# EAGLE design Atmelboard_test (EAGLE 5.09)
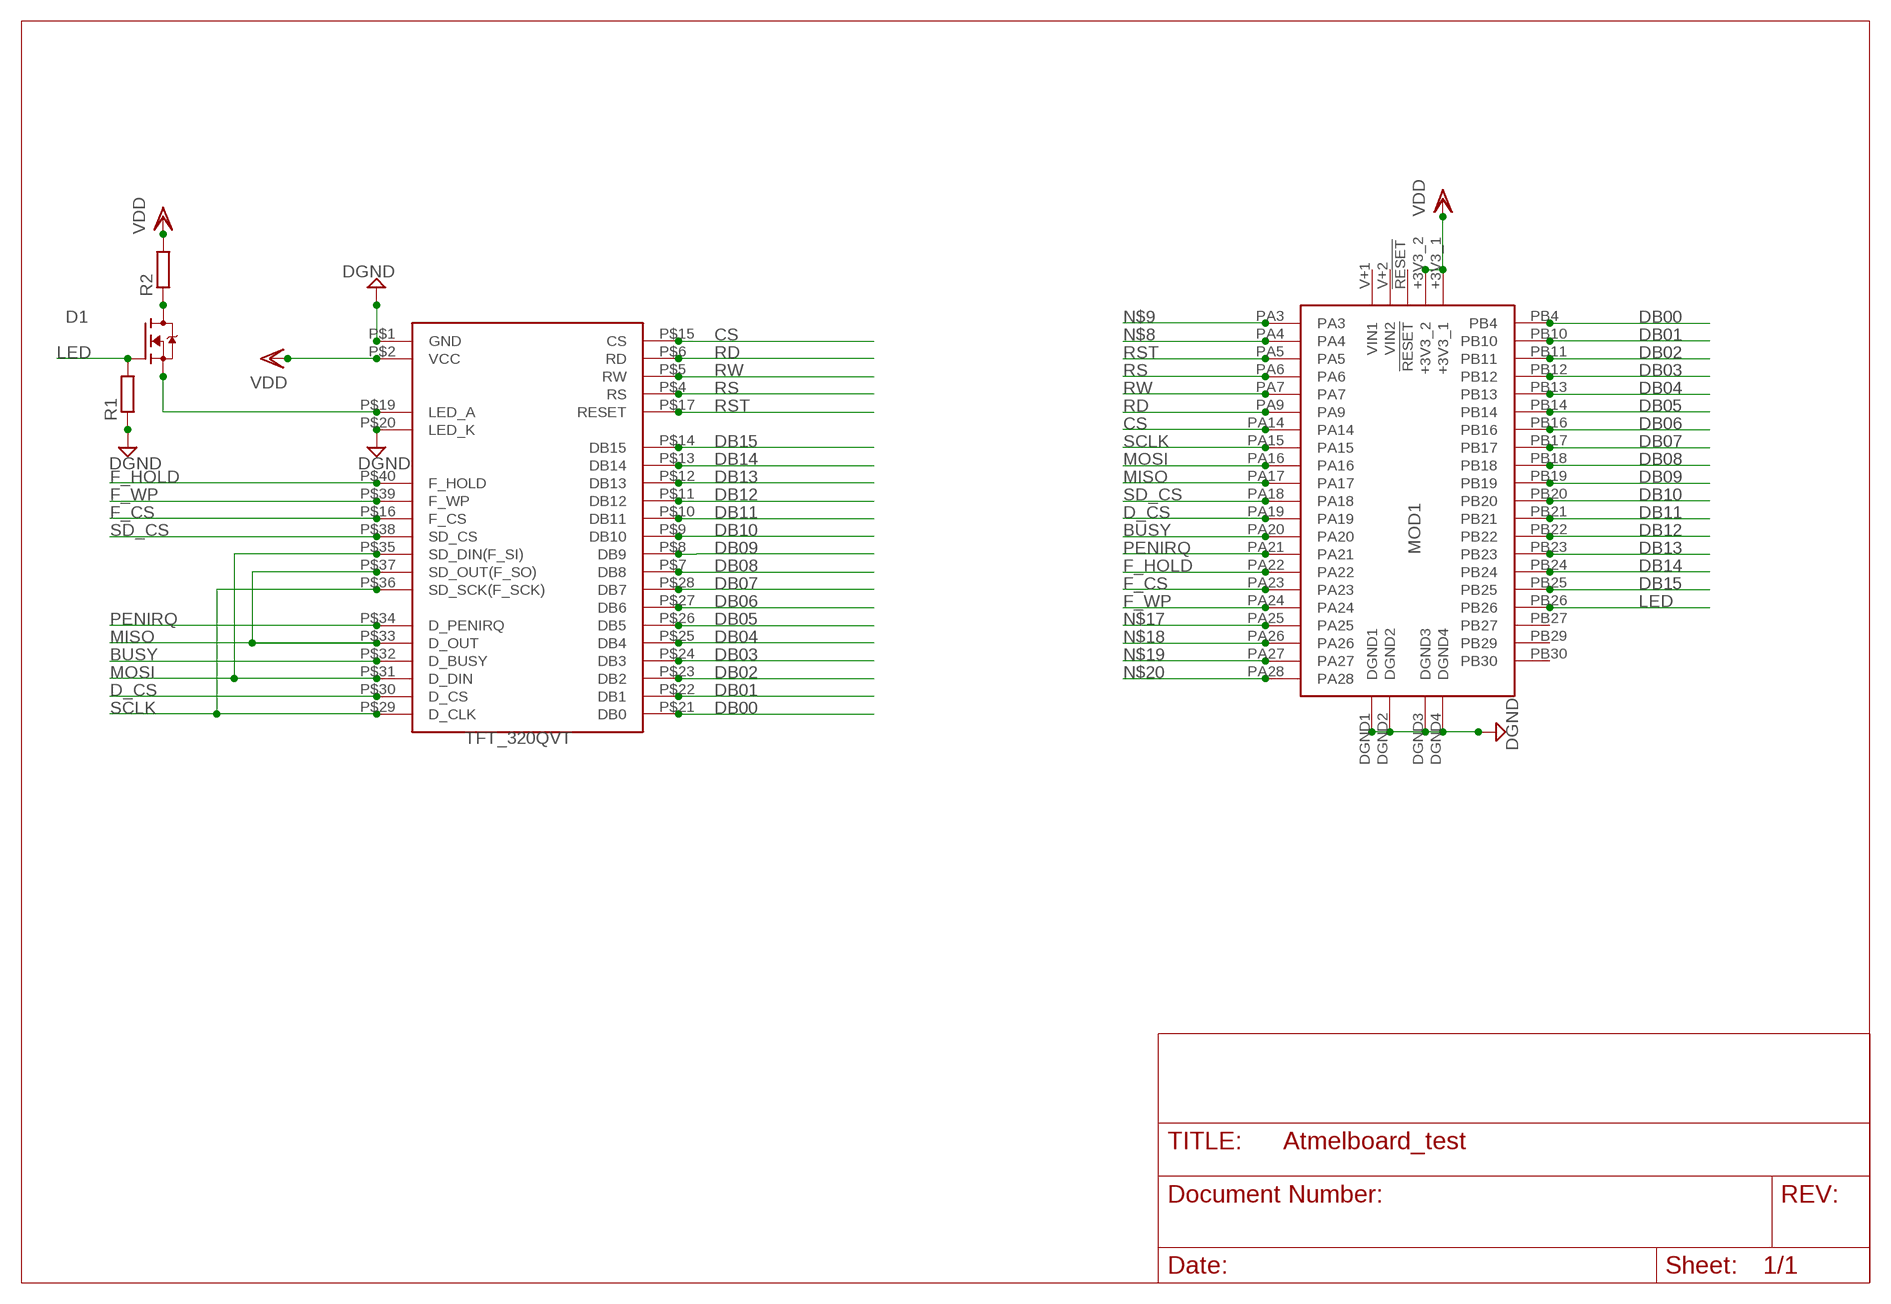
[diagram p0: schematic, sheet 1]

## Parts
D1  FDV303  [SOT23]
MOD1  ATMEL_EMPC  [EMPC_ATMEL]
R1  R-EU_0207/10  [0207/10]
R2  R-EU_0207/10  [0207/10]
TFT1  TFT_320QVT  [TFT320_QVT]

## Nets
BUSY: MOD1.PA20 TFT1.P$32(D_BUSY)
CS: MOD1.PA14 TFT1.P$15(CS)
D_CS: MOD1.PA19 TFT1.P$30(D_CS)
DB00: MOD1.PB4 TFT1.P$21(DB0)
DB01: MOD1.PB10 TFT1.P$22(DB1)
DB02: MOD1.PB11 TFT1.P$23(DB2)
DB03: MOD1.PB12 TFT1.P$24(DB3)
DB04: MOD1.PB13 TFT1.P$25(DB4)
DB05: MOD1.PB14 TFT1.P$26(DB5)
DB06: MOD1.PB16 TFT1.P$27(DB6)
DB07: MOD1.PB17 TFT1.P$28(DB7)
DB08: MOD1.PB18 TFT1.P$7(DB8)
DB09: MOD1.PB19 TFT1.P$8(DB9)
DB10: MOD1.PB20 TFT1.P$9(DB10)
DB11: MOD1.PB21 TFT1.P$10(DB11)
DB12: MOD1.PB22 TFT1.P$11(DB12)
DB13: MOD1.PB23 TFT1.P$12(DB13)
DB14: MOD1.PB24 TFT1.P$13(DB14)
DB15: MOD1.PB25 TFT1.P$14(DB15)
DGND: MOD1.DGND1 MOD1.DGND2 MOD1.DGND3 MOD1.DGND4 R1.1 TFT1.P$1(GND) TFT1.P$20(LED_K)
F_CS: MOD1.PA23 TFT1.P$16(F_CS)
F_HOLD: MOD1.PA22 TFT1.P$40(F_HOLD)
F_WP: MOD1.PA24 TFT1.P$39(F_WP)
LED: D1.1(G) MOD1.PB26 R1.2
MISO: MOD1.PA17 TFT1.P$33(D_OUT) TFT1.P$37(SD_OUT(F_SO))
MOSI: MOD1.PA16 TFT1.P$31(D_DIN) TFT1.P$35(SD_DIN(F_SI))
N$3: D1.3(D) R2.1
N$4: D1.2(S) TFT1.P$19(LED_A)
N$8: MOD1.PA4
N$9: MOD1.PA3
N$17: MOD1.PA25
N$18: MOD1.PA26
N$19: MOD1.PA27
N$20: MOD1.PA28
PENIRQ: MOD1.PA21 TFT1.P$34(D_PENIRQ)
RD: MOD1.PA9 TFT1.P$6(RD)
RS: MOD1.PA6 TFT1.P$4(RS)
RST: MOD1.PA5 TFT1.P$17(RESET)
RW: MOD1.PA7 TFT1.P$5(RW)
SCLK: MOD1.PA15 TFT1.P$29(D_CLK) TFT1.P$36(SD_SCK(F_SCK))
SD_CS: MOD1.PA18 TFT1.P$38(SD_CS)
VDD: MOD1.+3V3_1 MOD1.+3V3_2 R2.2 TFT1.P$2(VCC)
Unconnected: MOD1.!RESET MOD1.PB27 MOD1.PB29 MOD1.PB30

## Power pins joined to a net without a drawn wire
VIN1: MOD1.V+1(VIN1)
VIN2: MOD1.V+2(VIN2)

## Library data of the parts
D1 = transistor-fet:FDV303
MOD1 = extra_dev:ATMEL_EMPC
R1 R2 = rcl:R-EU_: RESISTOR, European symbol
TFT1 = extra_dev:TFT_320QVT

## Net classes
0 default: clearance 0.15 mm

## Board
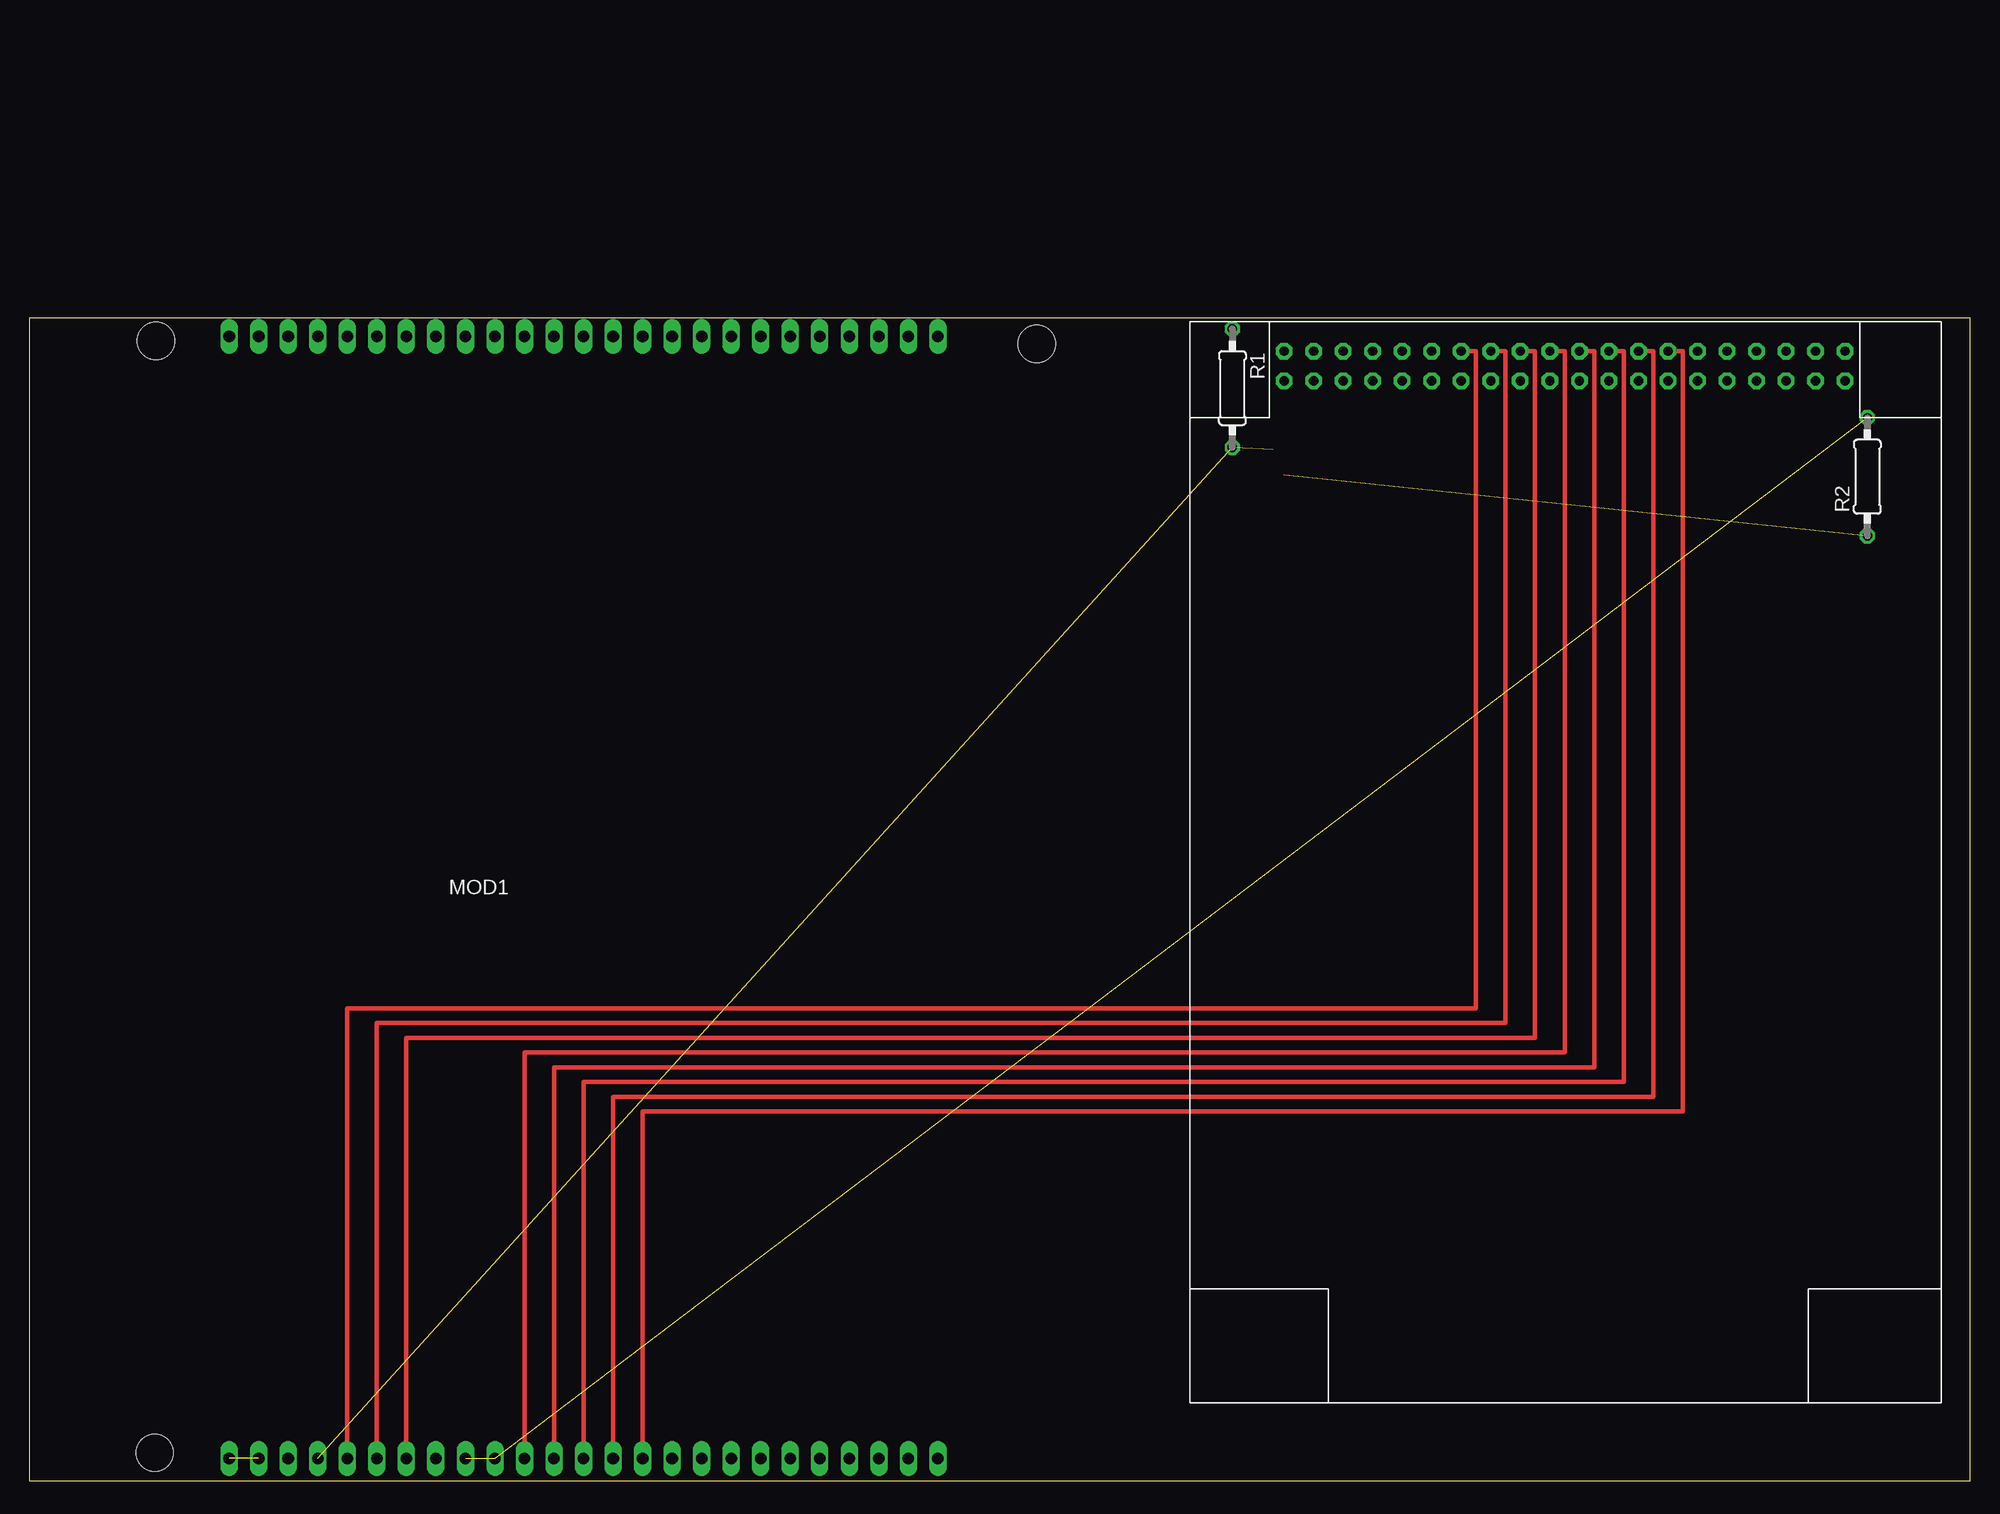
[diagram p1: board, top side]
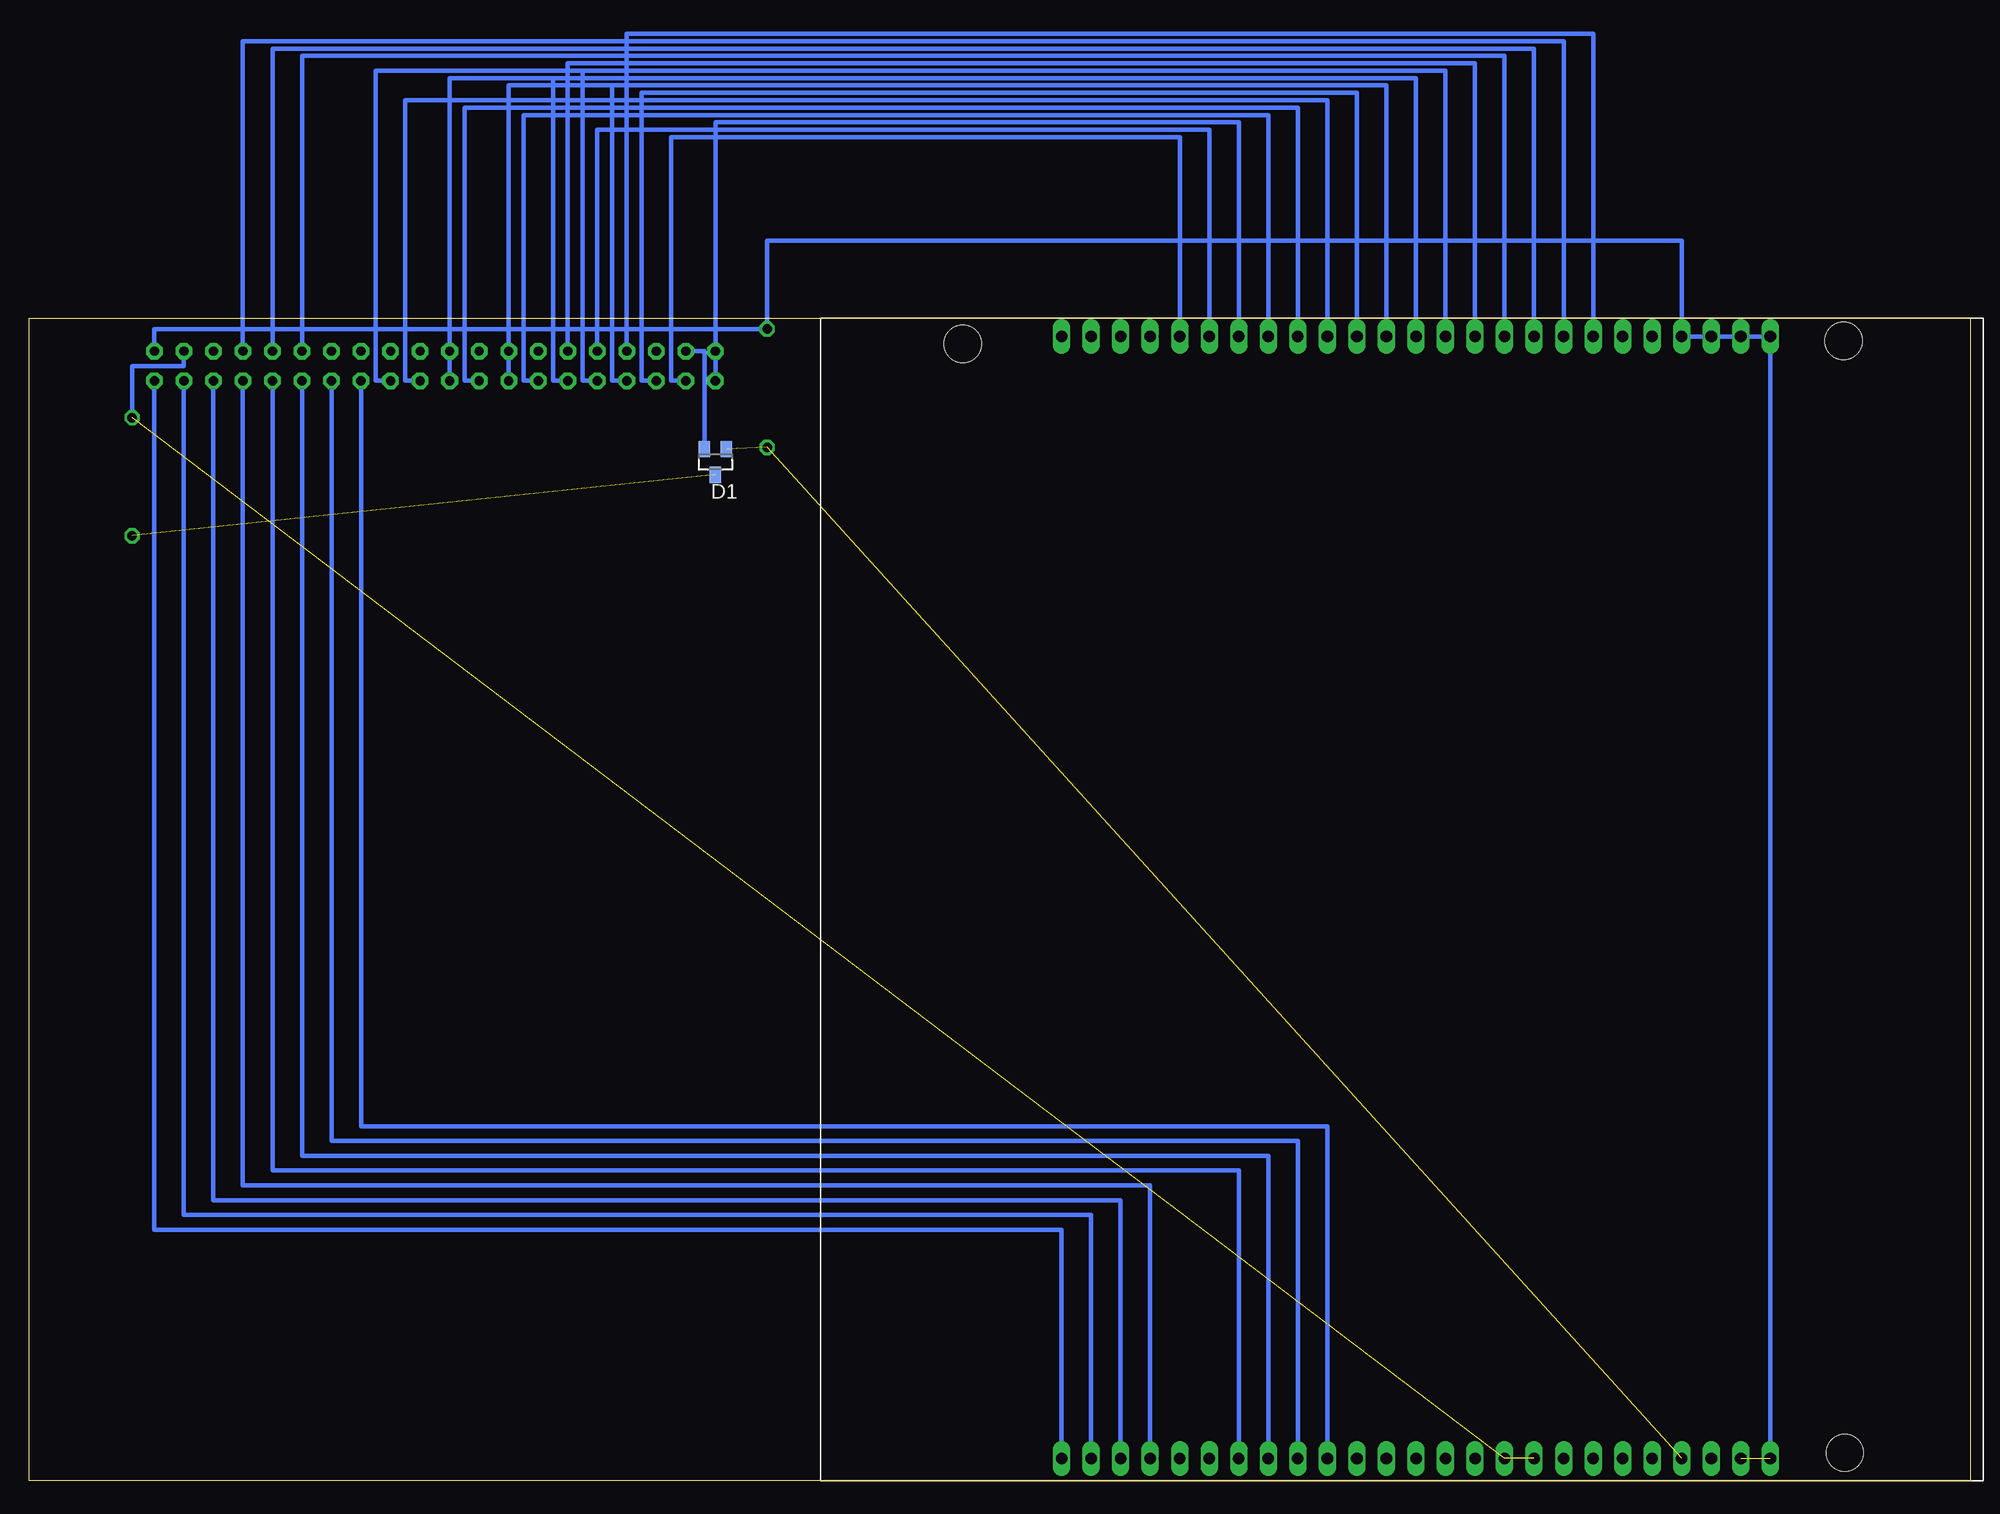
[diagram p2: board, bottom side, seen from below]

Size 166.99 x 100 mm. Coordinates in mm from the lower left corner, seen from the top.
Outline: 0,0 166.99,0 166.99,100 0,100 0,0
Copper layers (1*16): Top 0.035mm / dielectric 1.5mm / Bottom 0.035mm
Design rules "default": minimum track width 10mil, minimum drill 24mil, track to track 8mil, track to pad 8mil, pad to pad 8mil, via to via 8mil, smd to smd 8mil, copper to edge 40mil, drill to drill 8mil, minimum pad ring 10mil, minimum via ring 8mil, stop-mask expansion 4mil, vias tented up to drill 0mil, thermal gap 10mil

### Footprints (pad centres in the part's own frame; a part is rotated, then mirrored left to right if it is on the bottom)
SOT23 = smd 1 x 1.4: 1 -0.95,-1.1; 2 0.95,-1.1; 3 0,1.1
EMPC_ATMEL = drill 1 pad 1.5 long: !RESET 36.263,1.905; +3V3_1 41.343,1.905; +3V3_2 38.803,1.905; DGND1 26.102,98.425; DGND2 23.562,98.425; DGND3 21.023,1.905; DGND4 18.483,1.905; PA3 28.642,98.425; PA4 31.183,98.425; PA5 33.722,98.425; PA6 36.263,98.425; PA7 38.803,98.425; PA9 41.343,98.425; PA14 43.883,98.425; PA15 46.422,98.425; PA16 48.962,98.425; PA17 51.502,98.425; PA18 54.042,98.425; PA19 56.583,98.425; PA20 59.123,98.425; PA21 61.663,98.425; PA22 64.203,98.425; PA23 66.743,98.425; PA24 69.282,98.425; PA25 71.823,98.425; PA26 74.362,98.425; PA27 76.903,98.425; PA28 79.442,98.425; PB4 79.442,1.905; PB10 76.903,1.905; PB11 74.362,1.905; PB12 71.823,1.905; PB13 64.203,1.905; PB14 61.663,1.905; PB16 59.123,1.905; PB17 56.583,1.905; PB18 54.042,1.905; PB19 51.502,1.905; PB20 48.962,1.905; PB21 46.422,1.905; PB22 43.883,1.905; PB23 33.722,1.905; PB24 31.183,1.905; PB25 28.642,1.905; PB26 26.102,1.905; PB27 23.562,1.905; PB29 69.282,1.905; PB30 66.743,1.905; V+1 18.483,98.425; V+2 21.023,98.425 | hole 3.2: 12.072,2.4; 87.948,97.79; 12.197,98.04
0207/10 = drill 0.813 octagon: 1 -5.08,0; 2 5.08,0
TFT320_QVT = drill 0.8 pad 1.422 octagon: P$1 8.255,2.54; P$2 10.795,2.54; P$3 13.335,2.54; P$4 15.875,2.54; P$5 18.415,2.54; P$6 20.955,2.54; P$7 23.495,2.54; P$8 26.035,2.54; P$9 28.575,2.54; P$10 31.115,2.54; P$11 33.655,2.54; P$12 36.195,2.54; P$13 38.735,2.54; P$14 41.275,2.54; P$15 43.815,2.54; P$16 46.355,2.54; P$17 48.895,2.54; P$18 51.435,2.54; P$19 53.975,2.54; P$20 56.515,2.54; P$21 8.255,5.08; P$22 10.795,5.08; P$23 13.335,5.08; P$24 15.875,5.08; P$25 18.415,5.08; P$26 20.955,5.08; P$27 23.495,5.08; P$28 26.035,5.08; P$29 28.575,5.08; P$30 31.115,5.08; P$31 33.655,5.08; P$32 36.195,5.08; P$33 38.735,5.08; P$34 41.275,5.08; P$35 43.815,5.08; P$36 46.355,5.08; P$37 48.895,5.08; P$38 51.435,5.08; P$39 53.975,5.08; P$40 56.515,5.08

### Placement (x,y rotation side)
D1  107.95,87.63 180 bottom
MOD1  -1.27,0 0 top
R1  103.5,93.98 270 top
R2  158.12,86.36 90 top
TFT1  164.47,99.69 180 top

### Tracks (layer width: path | path; a pad name or v marks a point on that pad's centre or on a via)
BUSY
  Bottom 0.406: MOD1.PA20 57.85,118.11 97.79,118.11 99.06,118.11 129.54,118.11 129.54,94.61 TFT1.P$32
CS
  Bottom 0.406: MOD1.PA14 42.61,121.92 120.65,121.92 TFT1.P$15
D_CS
  Bottom 0.406: MOD1.PA19 55.31,118.75 97.79,118.75 98.42,118.75 134.62,118.75 134.62,94.61 TFT1.P$30
DB00
  Bottom 0.406: MOD1.PB4 78.17,21.59 156.21,21.59 TFT1.P$21
DB01
  Bottom 0.406: TFT1.P$22 153.67,22.86 75.63,22.86 MOD1.PB10
DB02
  Bottom 0.406: MOD1.PB11 73.09,24.13 151.13,24.13 TFT1.P$23
DB03
  Bottom 0.406: TFT1.P$24 148.59,25.4 70.55,25.4 MOD1.PB12
DB04
  Bottom 0.406: MOD1.PB13 62.93,26.67 146.05,26.67 TFT1.P$25
DB05
  Bottom 0.406: TFT1.P$26 143.51,27.94 60.39,27.94 MOD1.PB14
DB06
  Bottom 0.406: TFT1.P$27 140.97,29.21 57.85,29.21 MOD1.PB16
DB07
  Bottom 0.406: TFT1.P$28 138.43,30.48 55.31,30.48 MOD1.PB17
DB08
  Top 0.406: TFT1.P$7 142.24,97.16 142.24,31.75 52.77,31.75 MOD1.PB18
DB09
  Top 0.406: TFT1.P$8 139.7,97.16 139.7,33.02 50.23,33.02 MOD1.PB19
DB10
  Top 0.406: TFT1.P$9 137.16,97.16 137.16,34.29 47.69,34.29 MOD1.PB20
DB11
  Top 0.406: TFT1.P$10 134.62,97.16 134.62,35.56 45.15,35.56 MOD1.PB21
DB12
  Top 0.406: TFT1.P$11 132.08,97.16 132.08,36.83 42.61,36.83 MOD1.PB22
DB13
  Top 0.406: TFT1.P$12 129.54,97.16 129.54,38.1 32.45,38.1 MOD1.PB23
DB14
  Top 0.406: TFT1.P$13 127,97.16 127,39.37 29.91,39.37 MOD1.PB24
DB15
  Top 0.406: TFT1.P$14 124.46,97.16 124.46,40.64 27.37,40.64 MOD1.PB25
DGND  (1 unrouted)
  Bottom 0.406: TFT1.P$1 156.21,99.06 107.95,99.06 | 107.95,99.06 TFT1.P$20 | MOD1.DGND4 17.21,98.42 MOD1.DGND2 MOD1.DGND1 24.83,106.68 103.5,106.68 R1.1 107.95,99.06
F_CS
  Bottom 0.406: MOD1.PA23 65.47,116.2 118.11,116.2 TFT1.P$16
F_HOLD
  Bottom 0.406: MOD1.PA22 62.93,116.84 107.95,116.84 TFT1.P$40
F_WP
  Bottom 0.406: MOD1.PA24 68.01,115.57 97.16,115.57 98.42,115.57 111.76,115.57 111.76,94.61 TFT1.P$39
LED  (2 unrouted)
MISO
  Bottom 0.406: MOD1.PA17 50.23,120.02 111.12,120.02 116.84,120.02 | TFT1.P$37 116.84,94.61 116.84,120.02 | TFT1.P$33 125.73,120.02 116.84,120.02
MOSI
  Bottom 0.406: MOD1.PA16 47.69,120.65 115.57,120.65 121.92,120.65 | TFT1.P$35 121.92,94.61 121.92,120.65 | TFT1.P$31 130.81,120.65 121.92,120.65
N$3  (1 unrouted)
N$4
  Bottom 0.406: TFT1.P$19 108.9,97.16 D1.2
PENIRQ
  Bottom 0.406: MOD1.PA21 60.39,117.47 124.46,117.47 124.46,94.61 TFT1.P$34
RD
  Bottom 0.406: MOD1.PA9 40.07,122.56 97.16,122.56 98.42,122.56 143.51,122.56 TFT1.P$6
RS
  Bottom 0.406: MOD1.PA6 34.99,123.83 148.59,123.83 TFT1.P$4
RST
  Bottom 0.406: MOD1.PA5 32.45,124.46 98.42,124.46 99.06,124.46 115.57,124.46 TFT1.P$17
RW
  Bottom 0.406: MOD1.PA7 37.53,123.19 98.42,123.19 99.06,123.19 146.05,123.19 TFT1.P$5
SCLK
  Bottom 0.406: MOD1.PA15 45.15,121.28 117.47,121.28 119.38,121.28 | TFT1.P$36 119.38,94.61 119.38,121.28 | TFT1.P$29 137.16,94.61 137.16,121.28 119.38,121.28
SD_CS
  Bottom 0.406: MOD1.PA18 52.77,119.38 98.42,119.38 99.06,119.38 114.3,119.38 114.3,94.61 TFT1.P$38
VDD  (2 unrouted)
  Bottom 0.406: TFT1.P$2 153.67,95.89 158.12,95.89 R2.2